# Altium schematic sheet 5V_12V_Logic.SchDoc
size A
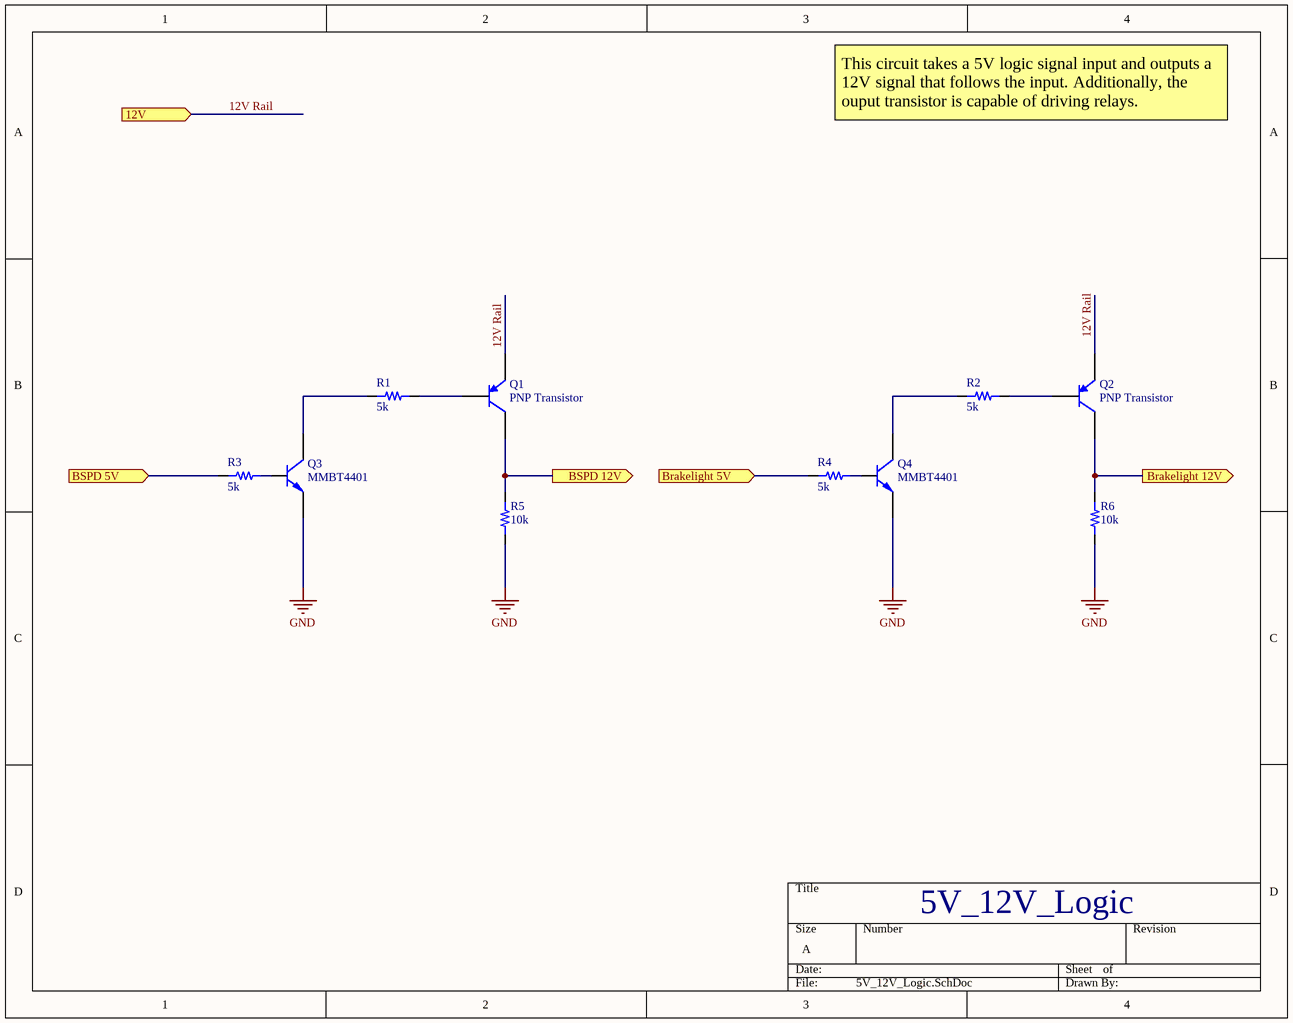
[diagram p0: 5V_12V_Logic.SchDoc]

## Parts
Q1  PNP Transistor  [SOT23-3]
Q2  PNP Transistor  [SOT23-3]
Q3  MMBT4401  [SOT23-3]
Q4  MMBT4401  [SOT23-3]
R1  resistance: 5k  [RES 0603/1608]  (hidden comment: resistor)
R2  resistance: 5k  [RES 0603/1608]  (hidden comment: resistor)
R3  resistance: 5k  [RES 0603/1608]  (hidden comment: resistor)
R4  resistance: 5k  [RES 0603/1608]  (hidden comment: resistor)
R5  resistance: 10k  [RES 0603/1608]  (hidden comment: resistor)
R6  resistance: 10k  [RES 0603/1608]  (hidden comment: resistor)

## Ports
12V (in), Brakelight 5V (in), Brakelight 12V (out), BSPD 5V (in), BSPD 12V (out)

## Nets
GND: Q3.2(E) Q4.2(E) R5.1 R6.1
12V Rail: Q1.2(E) Q2.2(E) ; port 12V
Brakelight 5V: R4.1 ; port Brakelight 5V
Brakelight 12V: Q2.3(C) R6.2 ; port Brakelight 12V
BSPD 5V: R3.1 ; port BSPD 5V
BSPD 12V: Q1.3(C) R5.2 ; port BSPD 12V
NetQ1_1: Q1.1(B) R1.2
NetQ2_1: Q2.1(B) R2.2
NetQ3_1: Q3.1(B) R3.2
NetQ3_3: Q3.3(C) R1.1
NetQ4_1: Q4.1(B) R4.2
NetQ4_3: Q4.3(C) R2.1

## Notes on the sheet
- This circuit takes a 5V logic signal input and outputs a 12V signal that follows the input. Additionally, the ouput transistor is capable of driving relays.
- 5V_12V_Logic

## Library data of the parts
Q1 Q2 = 13: Bipolar (BJT) Transistor PNP 25V 1.5A 100MHz; id: 13; name: MMSS8550-L-TP; power: 625; vcemax: 25; type: PNP; package: SOT23-3; quantity: 0; link: https://www.digikey.com/product-detail/en/micro-commercial-co/MMSS8550-L-TP/MMSS8550-L-TPMSCT-ND/2827205; createdby: Kevin; createddate: 10/16/2019 7:23:00 AM
Q3 Q4 = 2: id: 2; type: NPN; name: MMBT4401; package: SOT23-3; quantity: 0; link: https://www.digikey.com/product-detail/en/diodes-incorporated/MMBT4401-7-F/MMBT4401-FDICT-ND/775867
R1-R6 = 1: id: 1; name: 0603 Resistor; percent tolerance: 5; package: 0603; quantity: 0